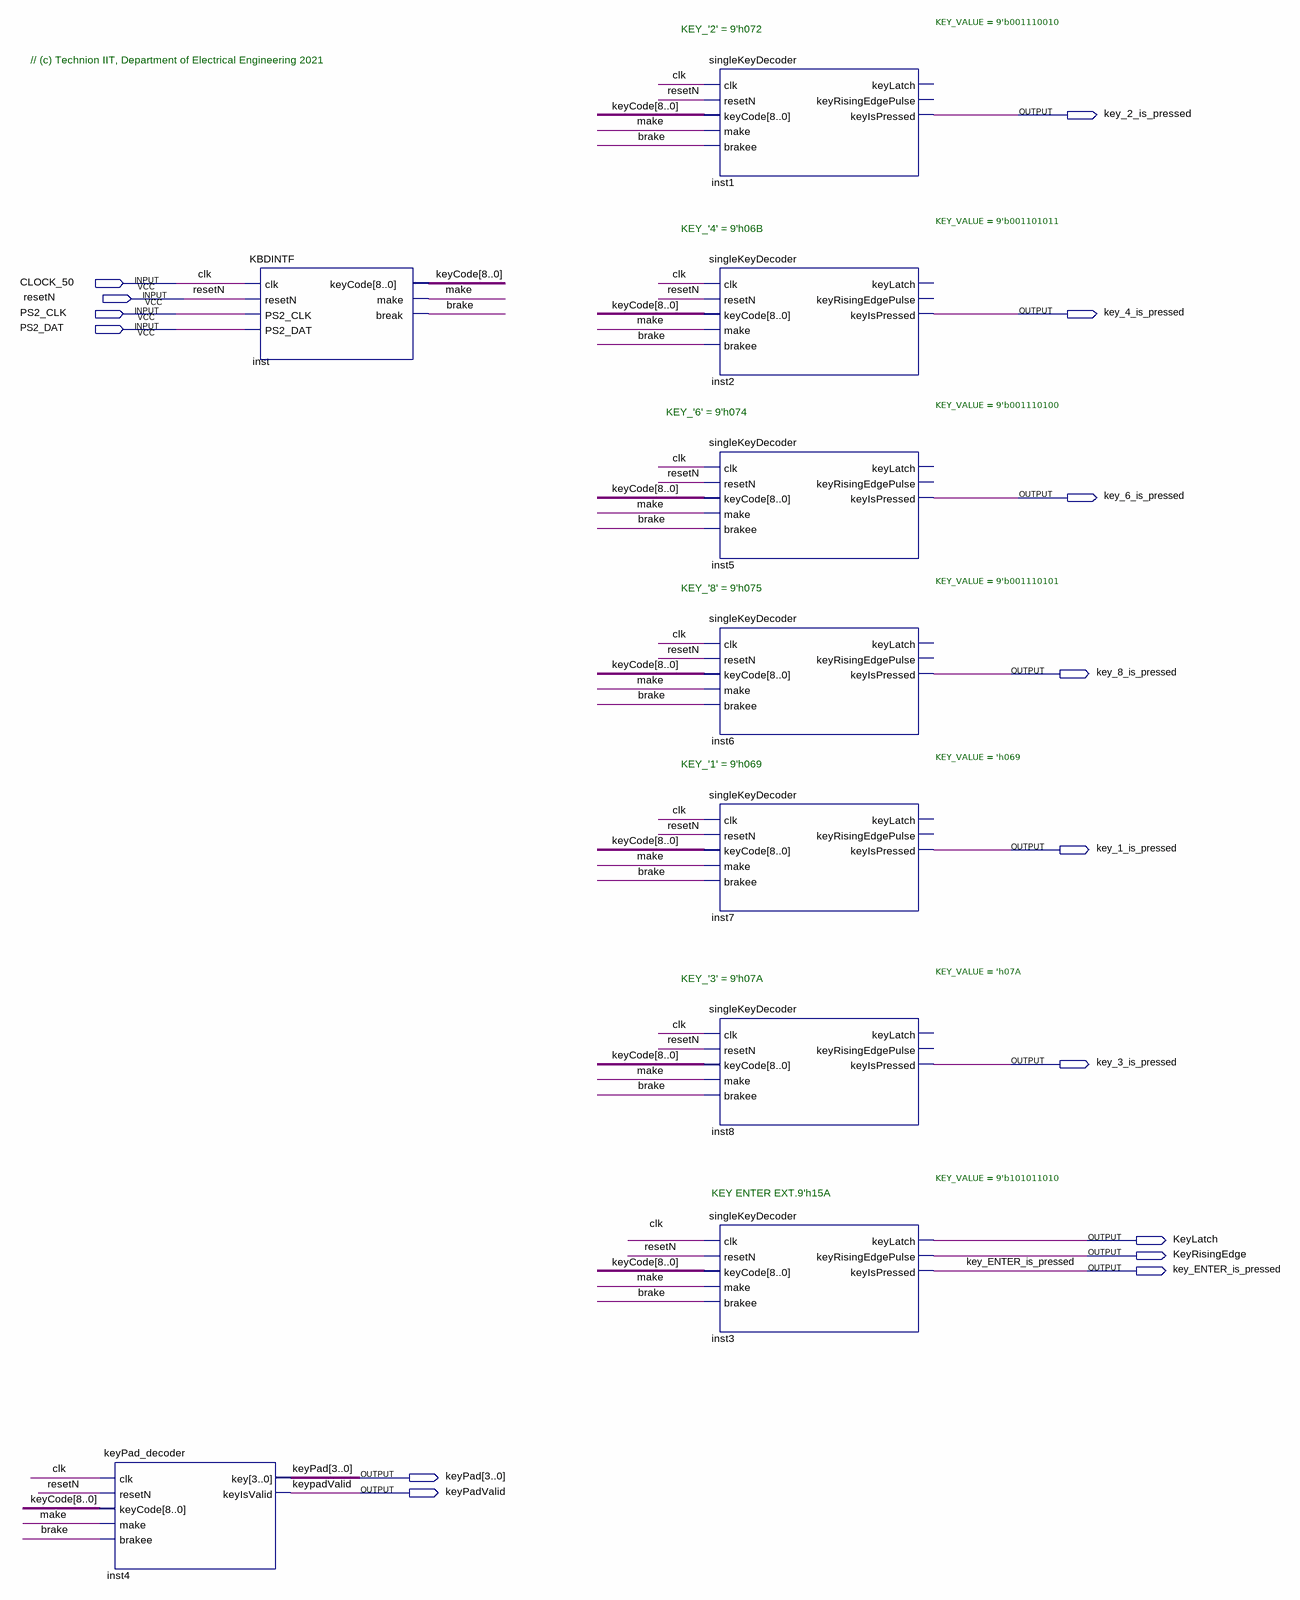
[diagram p0: schematic sheet]
// Quartus schematic KEYBOARD_INTERFACE.bdf as structural Verilog: 9 symbols, 15 pins
module KEYBOARD_INTERFACE (
  input  CLOCK_50,
  input  resetN,
  input  PS2_CLK,
  input  PS2_DAT,
  output key_2_is_pressed,
  output key_4_is_pressed,
  output key_6_is_pressed,
  output key_8_is_pressed,
  output key_1_is_pressed,
  output key_3_is_pressed,
  output KeyLatch,
  output KeyRisingEdge,
  output key_ENTER_is_pressed,
  output [3:0] keyPad,
  output keyPadValid
);

  wire brake, make;
  wire [8:0] keyCode;

  keyPad_decoder inst4 (
    .clk(CLOCK_50), .resetN(resetN), .keyCode(keyCode), .make(make), .brakee(brake), .key(keyPad),
    .keyIsValid(keyPadValid));
  KBDINTF inst (
    .clk(CLOCK_50), .resetN(resetN), .PS2_CLK(PS2_CLK), .PS2_DAT(PS2_DAT), .keyCode(keyCode), .make(make),
    .\break (brake));
  singleKeyDecoder #(.KEY_VALUE(9'b001110010)) inst1 (
    .clk(CLOCK_50), .resetN(resetN), .keyCode(keyCode), .make(make), .brakee(brake),
    .keyIsPressed(key_2_is_pressed));  // open: keyLatch, keyRisingEdgePulse
  singleKeyDecoder #(.KEY_VALUE(9'b001101011)) inst2 (
    .clk(CLOCK_50), .resetN(resetN), .keyCode(keyCode), .make(make), .brakee(brake),
    .keyIsPressed(key_4_is_pressed));  // open: keyLatch, keyRisingEdgePulse
  singleKeyDecoder #(.KEY_VALUE(9'b001110100)) inst5 (
    .clk(CLOCK_50), .resetN(resetN), .keyCode(keyCode), .make(make), .brakee(brake),
    .keyIsPressed(key_6_is_pressed));  // open: keyLatch, keyRisingEdgePulse
  singleKeyDecoder #(.KEY_VALUE(9'b001110101)) inst6 (
    .clk(CLOCK_50), .resetN(resetN), .keyCode(keyCode), .make(make), .brakee(brake),
    .keyIsPressed(key_8_is_pressed));  // open: keyLatch, keyRisingEdgePulse
  singleKeyDecoder #(.KEY_VALUE('h069)) inst7 (
    .clk(CLOCK_50), .resetN(resetN), .keyCode(keyCode), .make(make), .brakee(brake),
    .keyIsPressed(key_1_is_pressed));  // open: keyLatch, keyRisingEdgePulse
  singleKeyDecoder #(.KEY_VALUE('h07A)) inst8 (
    .clk(CLOCK_50), .resetN(resetN), .keyCode(keyCode), .make(make), .brakee(brake),
    .keyIsPressed(key_3_is_pressed));  // open: keyLatch, keyRisingEdgePulse
  singleKeyDecoder #(.KEY_VALUE(9'b101011010)) inst3 (
    .clk(CLOCK_50), .resetN(resetN), .keyCode(keyCode), .make(make), .brakee(brake), .keyLatch(KeyLatch),
    .keyRisingEdgePulse(KeyRisingEdge), .keyIsPressed(key_ENTER_is_pressed));

  // Other names for the same wires on the sheet: clk = CLOCK_50

  // Notes on the sheet:
  //   KEY_'2' = 9'h072
  //   // (c) Technion IIT, Department of Electrical Engineering 2021 
  //   KEY_'4' = 9'h06B
  //   KEY_'6' = 9'h074
  //   KEY_'8' = 9'h075
  //   KEY_'1' = 9'h069
  //   KEY_'3' = 9'h07A
  //   KEY ENTER EXT.9'h15A
endmodule
